# EasyEDA schematic Side_Sensor.json
TITLE: Drone_Side_Sensor; REV: 1.0; Date: 2024-01-21; Sheet: 1/1; Drawn By: cjh9760; Company: CJH
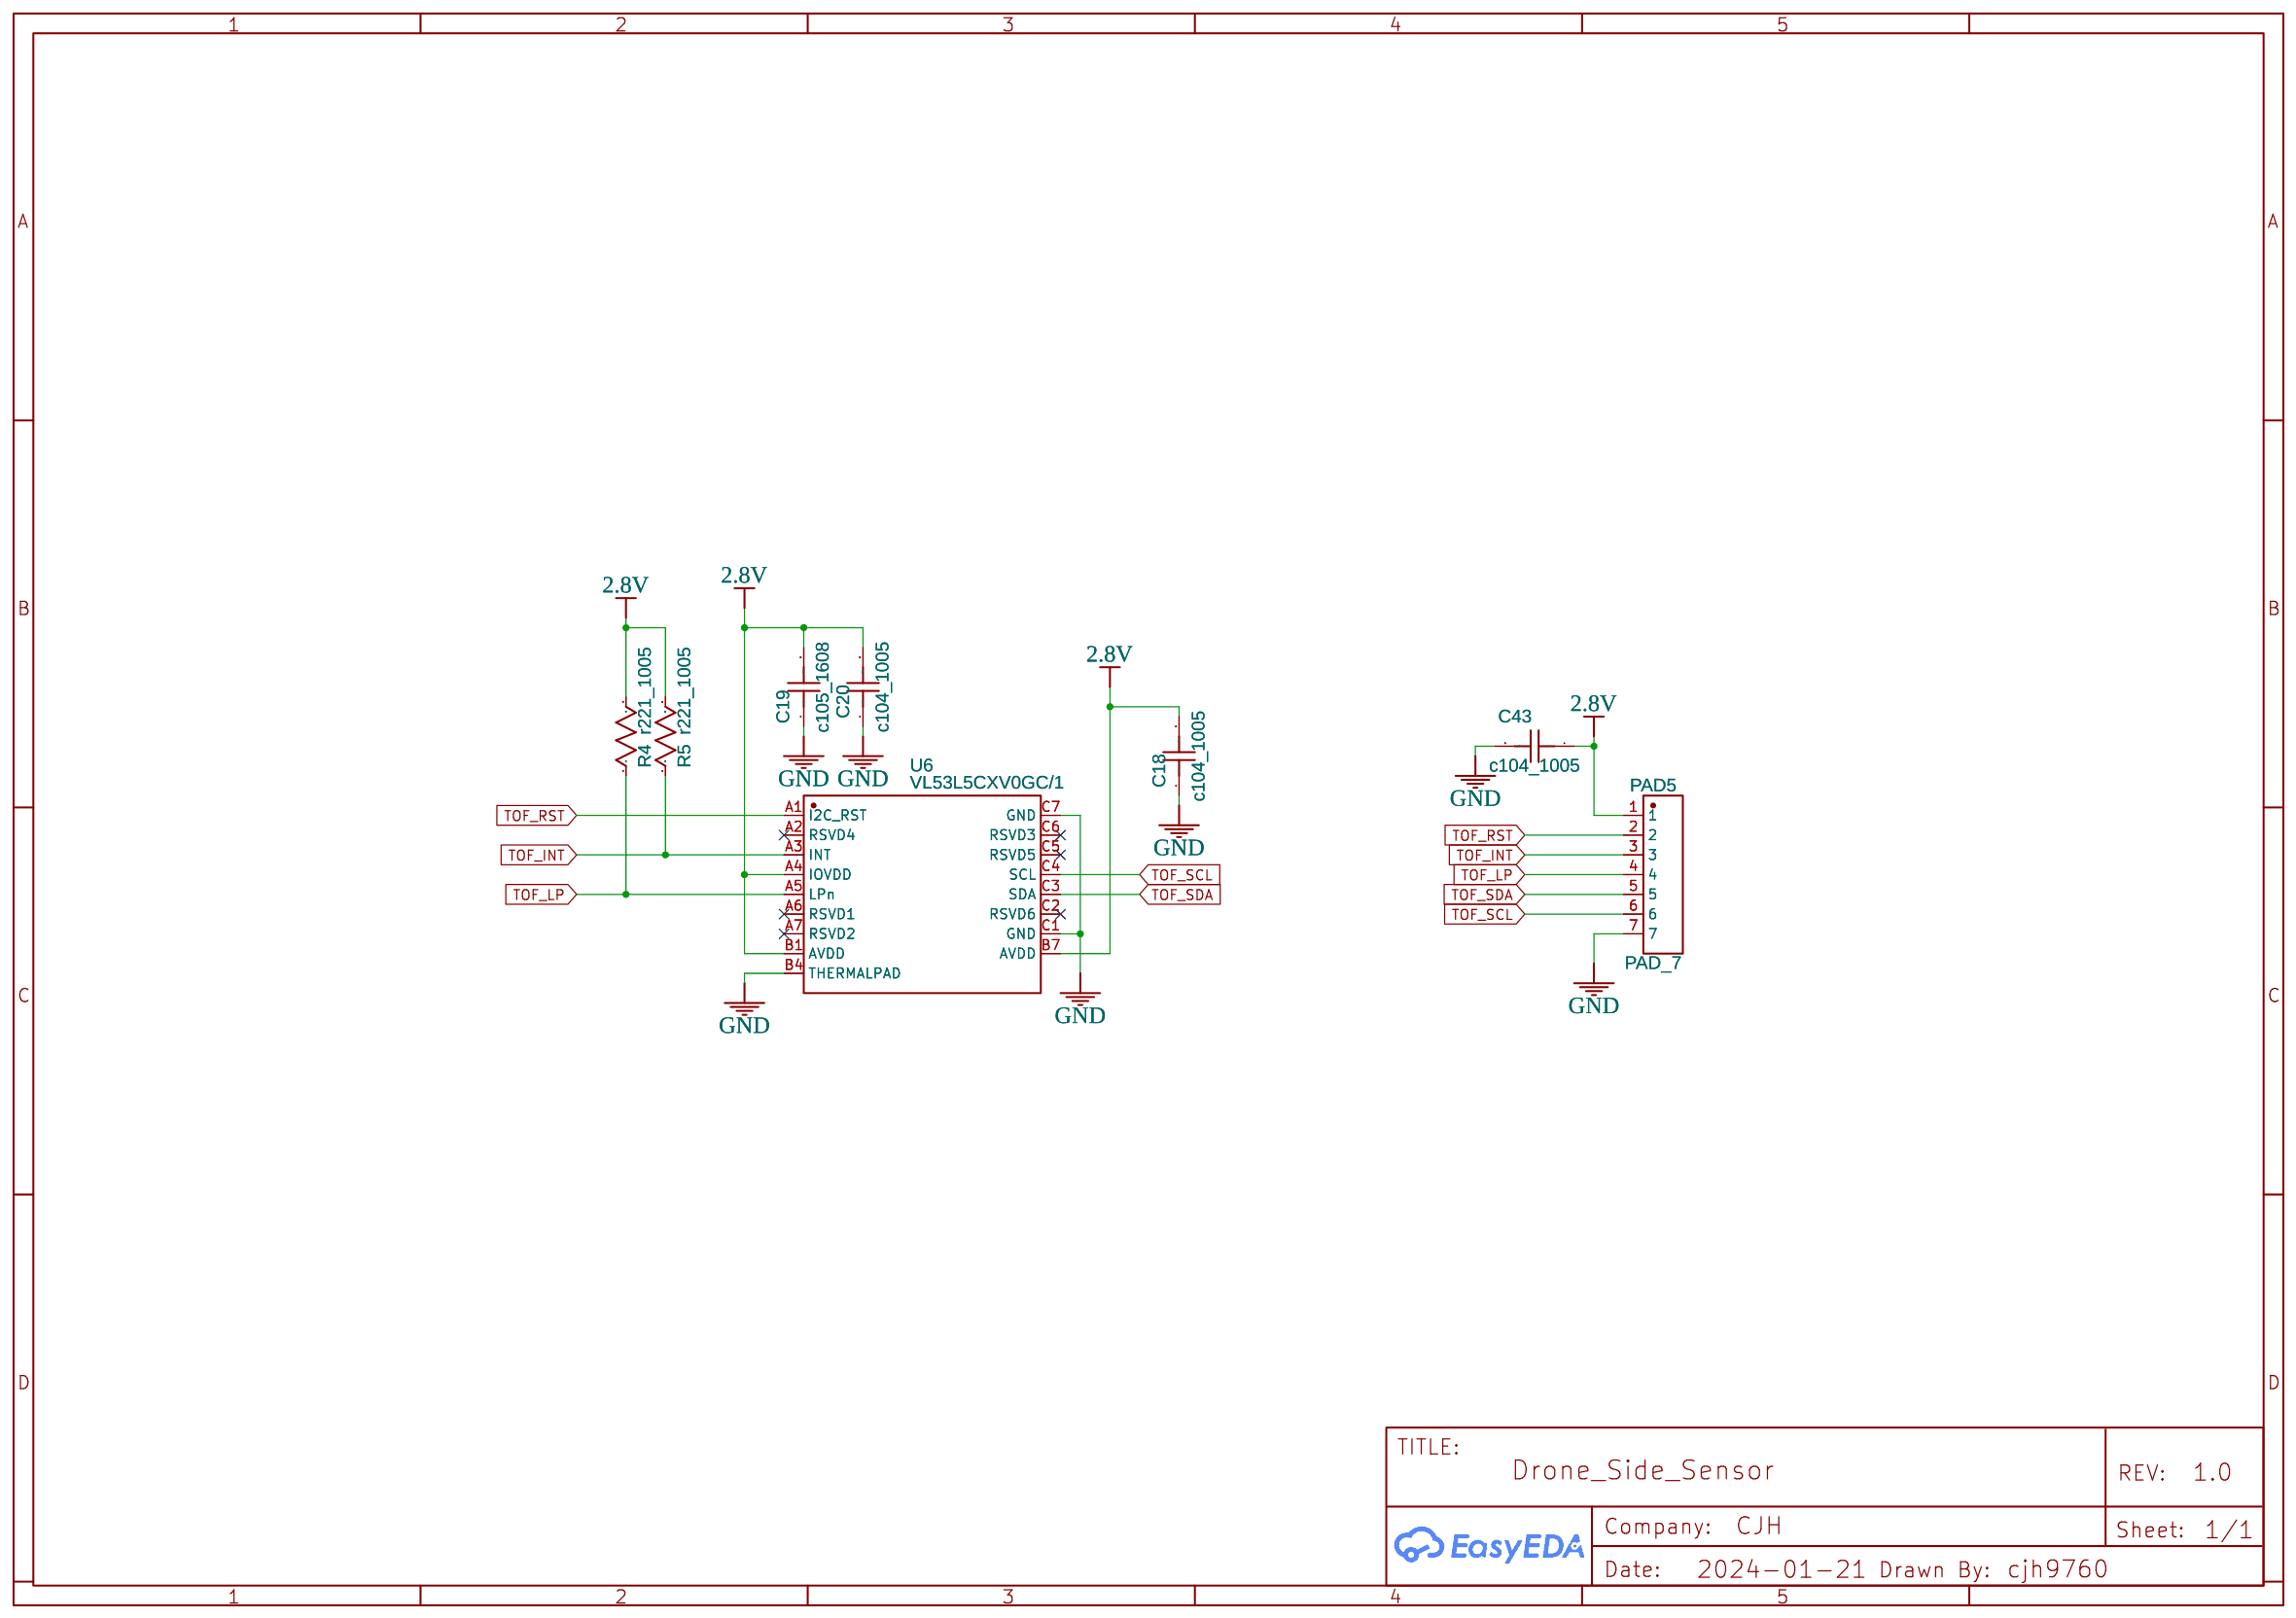
[diagram p0: schematic sheet]

## Parts
C18  c104_1005  [C0402]
C19  c105_1608  [C0603]
C20  c104_1005  [C0402]
C43  c104_1005  [C0402]
PAD5  PAD_7  [PAD_7]
R4  r221_1005  [R0402]
R5  r221_1005  [R0402]
U6  VL53L5CXV0GC/1  [LGA-16_L6.4-W3.0_VL53L5CXV0GC-1]

## Library data of the parts
C18 C20 C43 = C_0402_US: Contributor: LCEDA_Lib
C19 = C_0603_US: Contributor: LCEDA_Lib
PAD5 = PAD_7: Contributor: Guest
R4 R5 = R_0402_US: Contributor: LCEDA_Lib
U6 = VL53L5CXV0GC/1: Contributor: lcsc; Supplier: LCSC; Supplier Part: C3178303; Manufacturer: ST(意法半导体); JLCPCB Part Class: Extended Part

## Nets
2.8V: C18.2 C19.2 C20.2 C43.1 PAD5.1 R4.2 R5.2 U6.A4(IOVDD) U6.B1(AVDD) U6.B7(AVDD)
GND: C18.1 C19.1 C20.1 C43.2 PAD5.7 U6.B4(THERMALPAD) U6.C1(GND) U6.C7(GND)
TOF_INT: PAD5.3 R5.1 U6.A3(INT)
TOF_LP: PAD5.4 R4.1 U6.A5(LPn)
TOF_RST: PAD5.2 U6.A1(I2C_RST)
TOF_SCL: PAD5.6 U6.C4(SCL)
TOF_SDA: PAD5.5 U6.C3(SDA)

Not connected (* = marked no-connect by the designer): U6 A2(RSVD4)* A6(RSVD1)* A7(RSVD2)* C2(RSVD6)* C5(RSVD5)* C6(RSVD3)*
